# EAGLE design bms_board (EAGLE 6.5.0)
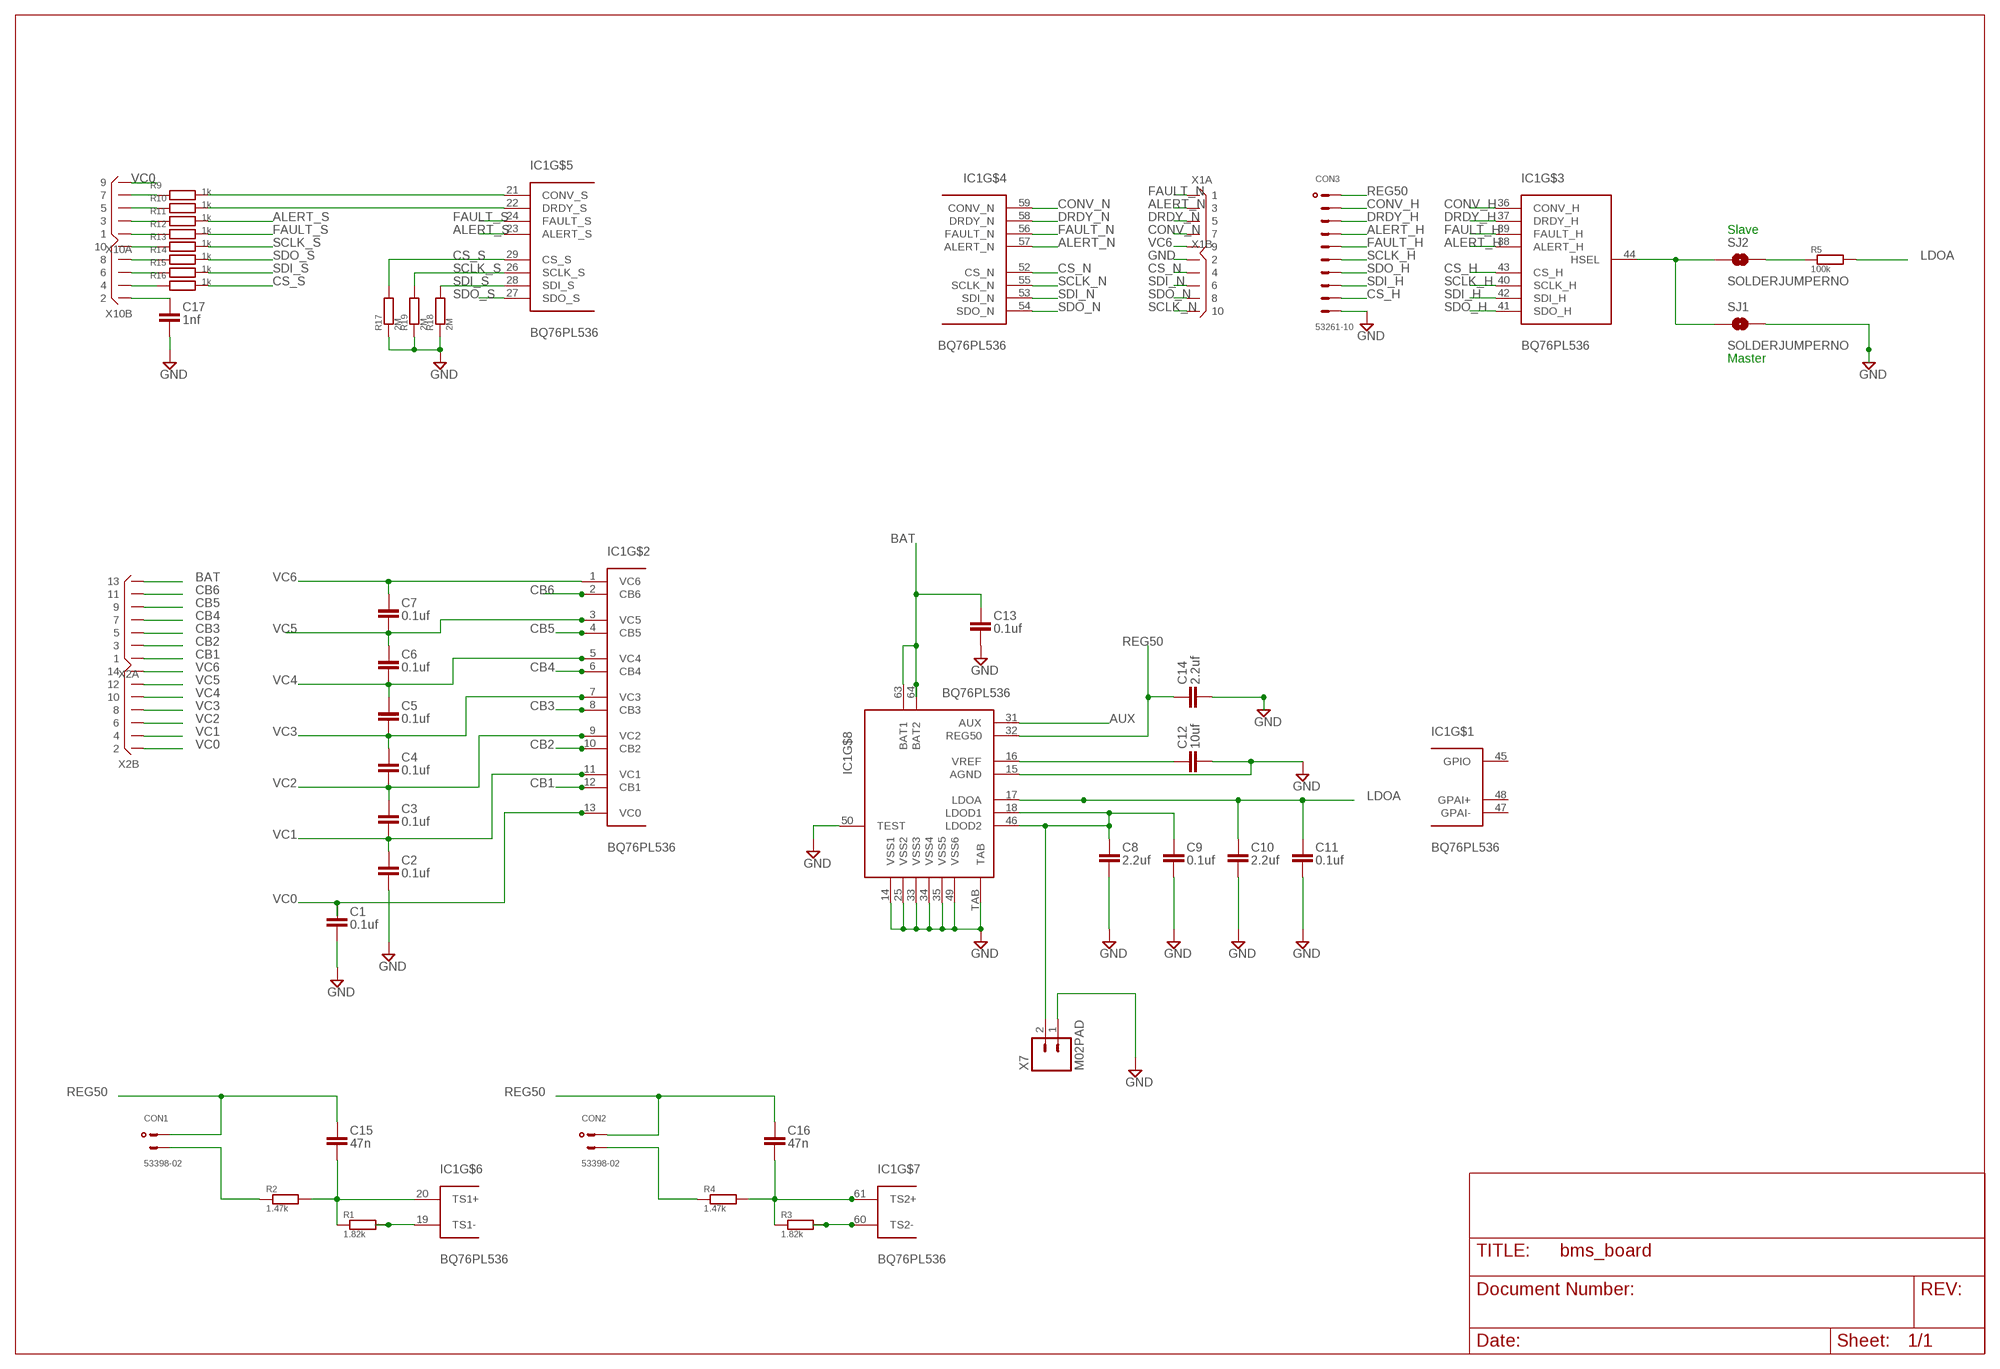
[diagram p0: schematic, sheet 1]

## Parts
C1  0.1uf  CSTD  [C0805]
C2  0.1uf  CSTD  [C0805]
C3  0.1uf  CSTD  [C0805]
C4  0.1uf  CSTD  [C0805]
C5  0.1uf  CSTD  [C0805]
C6  0.1uf  CSTD  [C0805]
C7  0.1uf  CSTD  [C0805]
C8  2.2uf  CSTD  [C0805]
C9  0.1uf  CSTD  [C0805]
C10  2.2uf  CSTD  [C0805]
C11  0.1uf  CSTD  [C0805]
C12  10uf  CSTD  [C0805]
C13  0.1uf  CSTD  [C0805]
C14  2.2uf  CSTD  [C0805]
C15  47n  CSTD  [C0805]
C16  47n  CSTD  [C0805]
C17  1nf  CSTD  [C0805]
CON1  53398-02  [53398-02]
CON2  53398-02  [53398-02]
CON3  53261-10  [53261-10]
IC1  BQ76PL536  [LQFP-64]
R1  1.82k  R  [R0805]
R2  1.47k  R  [R0805]
R3  1.82k  R  [R0805]
R4  1.47k  R  [R0805]
R5  100k  R  [R0805]
R9  1k  R  [R0805]
R10  1k  R  [R0805]
R11  1k  R  [R0805]
R12  1k  R  [R0805]
R13  1k  R  [R0805]
R14  1k  R  [R0805]
R15  1k  R  [R0805]
R16  1k  R  [R0805]
R17  2M  R  [R0805]
R18  2M  R  [R0805]
R19  2M  R  [R0805]
SJ1  SOLDERJUMPERNO  [SJ_2S-NO]
SJ2  SOLDERJUMPERNO  [SJ_2S-NO]
X1  X05X2ICR  [X10ICR]
X2  X07X2IR  [X14R-IDC]
X7  M02PAD  [1X02]
X10  X05X2ICR  [X10ICR]

## Nets
ALERT_H: CON3.4 IC1.38(ALERT_H)
ALERT_N: IC1.57(ALERT_N) X1.3
ALERT_S: IC1.23(ALERT_S) R11.2
AUX: IC1.31(AUX)
BAT: C13.2 IC1.63(BAT1) IC1.64(BAT2) X2.13
CB1: IC1.12(CB1) X2.1
CB2: IC1.10(CB2) X2.3
CB3: IC1.8(CB3) X2.5
CB4: IC1.6(CB4) X2.7
CB5: IC1.4(CB5) X2.9
CB6: IC1.2(CB6) X2.11
CONV_H: CON3.2 IC1.36(CONV_H)
CONV_N: IC1.59(CONV_N) X1.7
CONV_S: IC1.21(CONV_S) R9.2
CS_H: CON3.9 IC1.43(CS_H)
CS_N: IC1.52(CS_N) X1.4
CS_S: IC1.29(CS_S) R16.2 R17.2
DRDY_H: CON3.3 IC1.37(DRDY_H)
DRDY_N: IC1.58(DRDY_N) X1.5
DRDY_S: IC1.22(DRDY_S) R10.2
FAULT_H: CON3.5 IC1.39(FAULT_H)
FAULT_N: IC1.56(FAULT_N) X1.1
FAULT_S: IC1.24(FAULT_S) R12.2
GND: C1.1 C2.1 C8.1 C9.1 C10.1 C11.1 C12.1 C13.1 C14.1 C17.1 CON3.10 IC1.14(VSS1) IC1.15(AGND) IC1.25(VSS2) IC1.33(VSS3) IC1.34(VSS4) IC1.35(VSS5) IC1.49(VSS6) IC1.50(TEST) IC1.TAB R17.1 R18.1 R19.1 SJ1.2 X1.2 X7.1
LDOA: C10.2 C11.2 IC1.17(LDOA) R5.2
N$1: IC1.44(HSEL) SJ1.1 SJ2.1
N$2: C8.2 C9.2 IC1.18(LDOD1) IC1.46(LDOD2) X7.2
N$3: C12.2 IC1.16(VREF)
N$4: IC1.19(TS1-) R1.2
N$5: CON1.2 R2.1
N$6: C15.1 IC1.20(TS1+) R1.1 R2.2
N$7: IC1.60(TS2-) R3.2
N$8: C16.1 IC1.61(TS2+) R3.1 R4.2
N$9: CON2.2 R4.1
N$10: R5.1 SJ2.2
N$23: R16.1 X10.4
N$24: R15.1 X10.6
N$25: R14.1 X10.8
N$26: R13.1 X10.10
N$27: R12.1 X10.1
N$28: R11.1 X10.3
N$29: R10.1 X10.5
N$30: R9.1 X10.7
N$32: C17.2 X10.2
REG50: C14.2 C15.2 C16.2 CON1.1 CON2.1 CON3.1 IC1.32(REG50)
SCLK_H: CON3.6 IC1.40(SCLK_H)
SCLK_N: IC1.55(SCLK_N) X1.10
SCLK_S: IC1.26(SCLK_S) R13.2 R19.2
SDI_H: CON3.8 IC1.42(SDI_H)
SDI_N: IC1.53(SDI_N) X1.6
SDI_S: IC1.28(SDI_S) R15.2 R18.2
SDO_H: CON3.7 IC1.41(SDO_H)
SDO_N: IC1.54(SDO_N) X1.8
SDO_S: IC1.27(SDO_S) R14.2
VC0: C1.2 IC1.13(VC0) X2.2 X10.9
VC1: C2.2 C3.1 IC1.11(VC1) X2.4
VC2: C3.2 C4.1 IC1.9(VC2) X2.6
VC3: C4.2 C5.1 IC1.7(VC3) X2.8
VC4: C5.2 C6.1 IC1.5(VC4) X2.10
VC5: C6.2 C7.1 IC1.3(VC5) X2.12
VC6: C7.2 IC1.1(VC6) X1.9 X2.14
Unconnected: IC1.45(GPIO) IC1.47(GPAI-) IC1.48(GPAI+)

## Notes on the sheet
- Slave
- Master

## Library data of the parts
C1-C17 = useful:C
CON1 CON2 = con-molex:53?-02: CONNECTOR wire to board 1.25 mm (.049 inch) pitch header
CON3 = con-molex:53?-10: CONNECTOR wire to board 1.25 mm (.049 inch) pitch header
IC1 = ti:BQ76PL536
R1-R5 R9-R19 = useful:R
SJ1 SJ2 = useful:SOLDERJUMPER: Solder Jumper Standard SMD solder jumper. Used to automate production. Two varients : Normally Open and Normally Closed are the same, but have different paste layers. NC will have a large amount of paste and should jumper during reflow.
X1 X10 = connectors:X05X2: Connector 2x5 pins
X2 = connectors:X07X2: Connector 2x7 pins
X7 = stiftleisten:M02

## Board
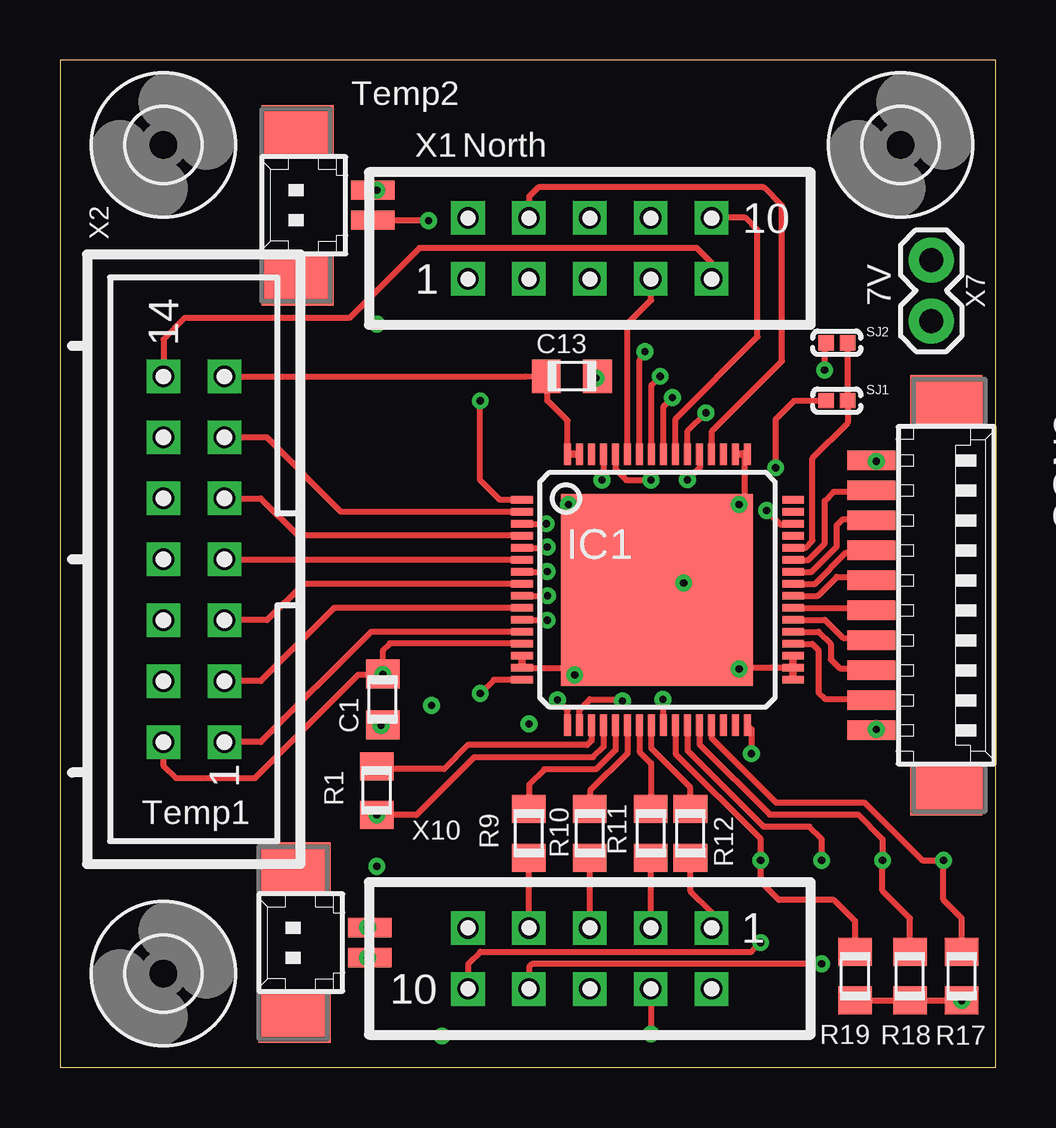
[diagram p1: board, top side]
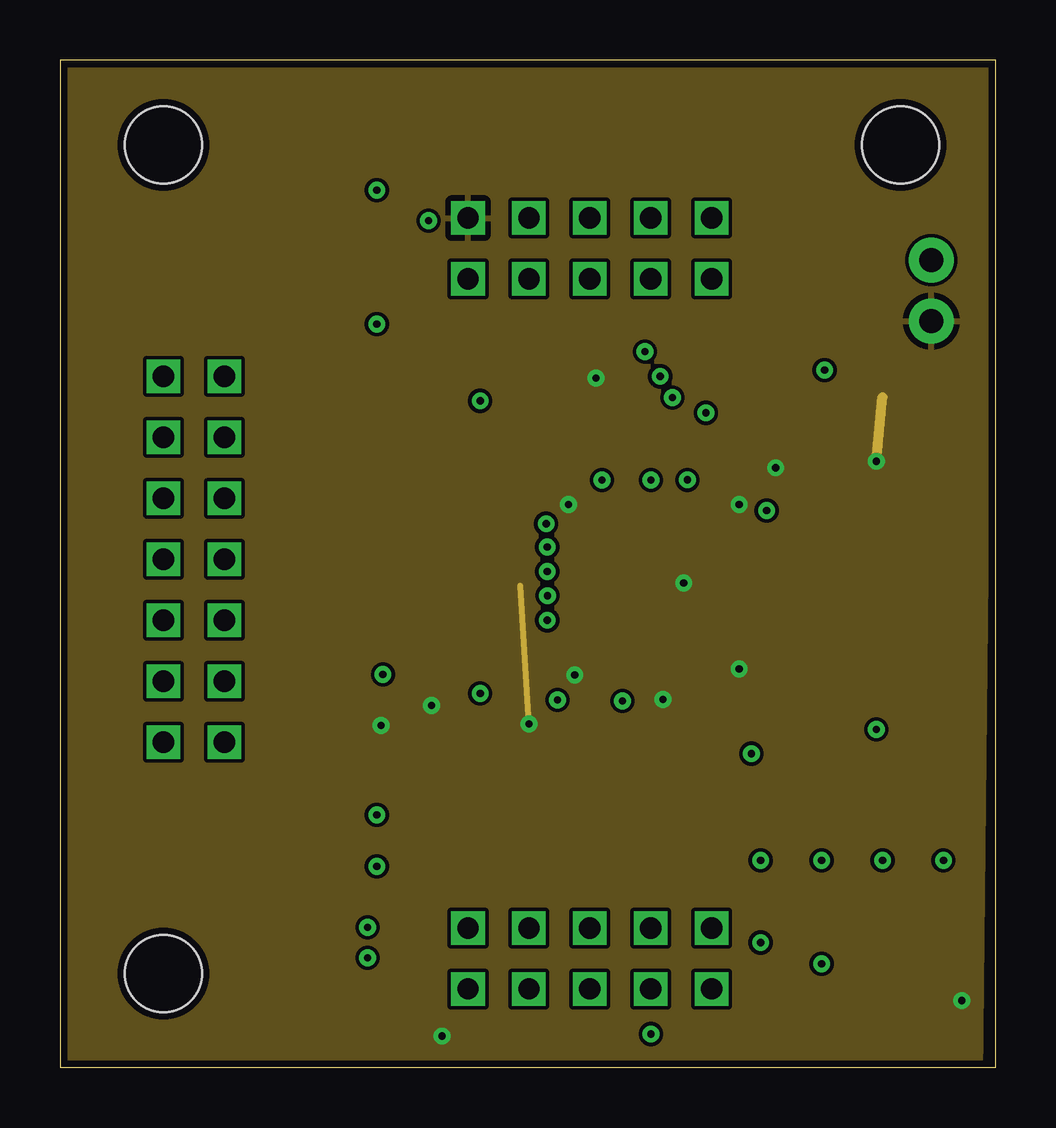
[diagram p2: board, inner layer Route2]
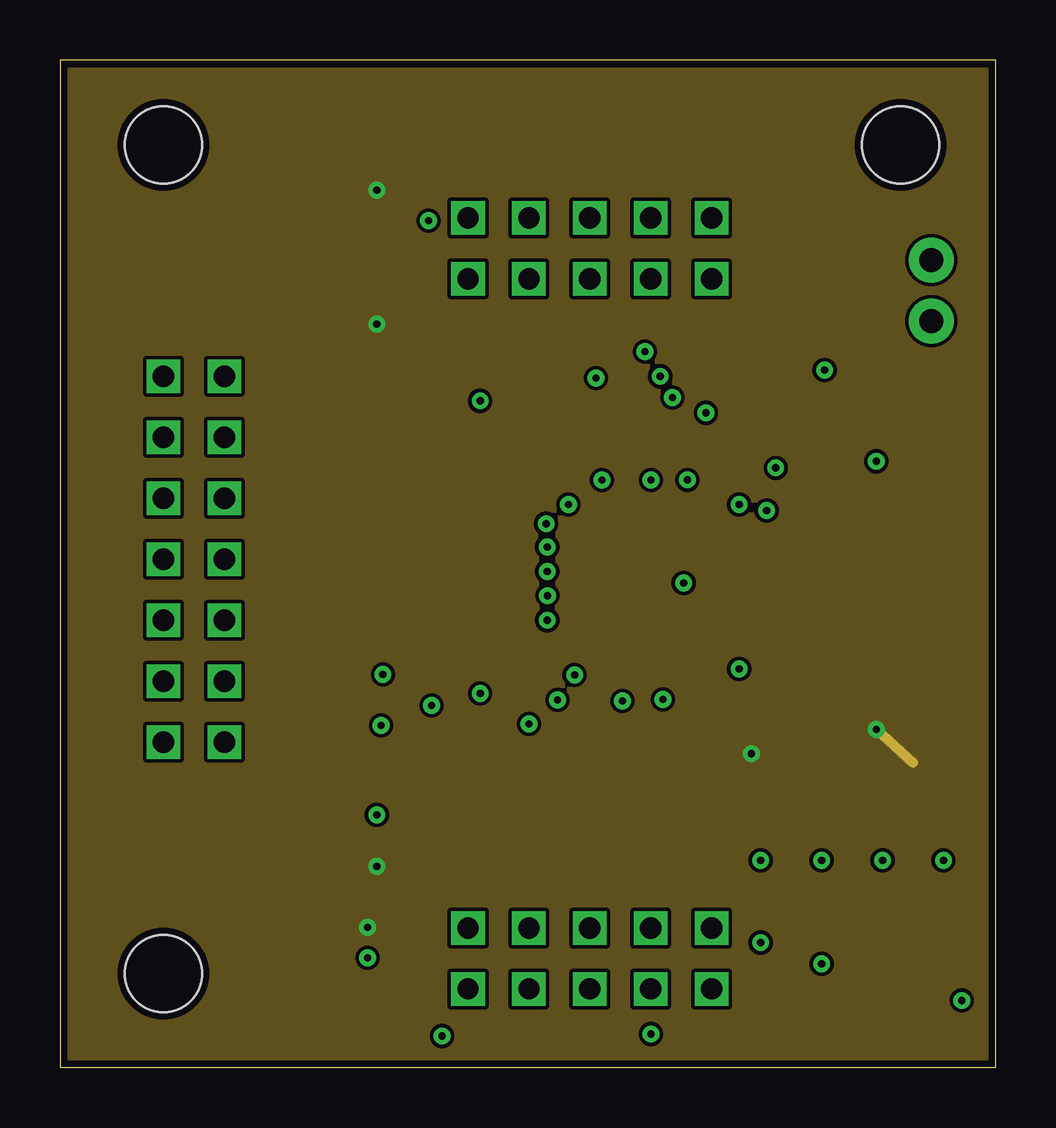
[diagram p3: board, inner layer Route15]
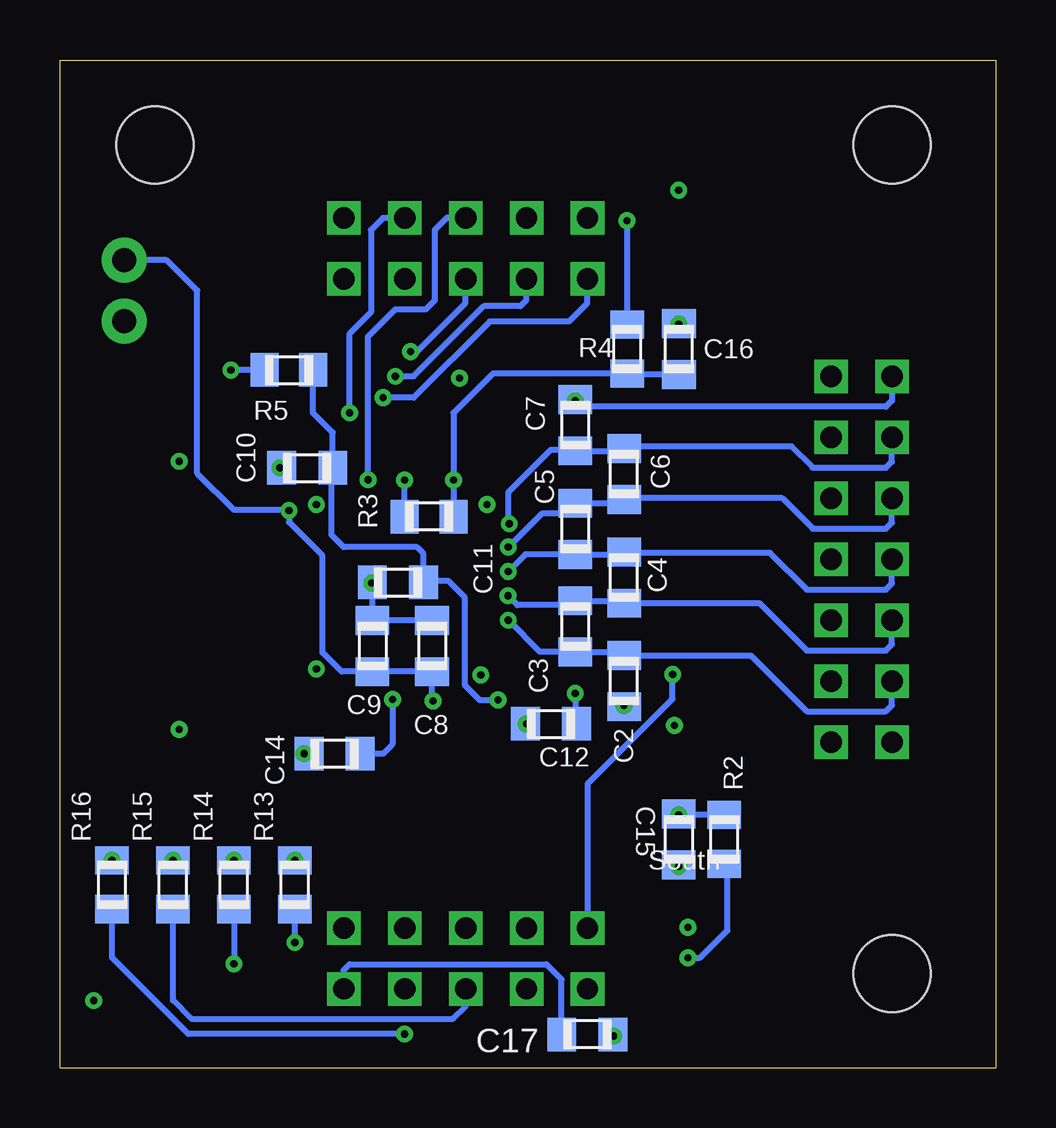
[diagram p4: board, bottom side, seen from below]

Size 39 x 42 mm. Coordinates in mm from the lower left corner, seen from the top.
Outline: 39,0 39,42 0,42 0,0 39,0
Copper layers (1+2*15+16): Top 0.035mm / dielectric 0.2mm / Route2 0.035mm / dielectric 0.5mm / Route15 0.035mm / dielectric 0.2mm / Bottom 0.035mm
Design rules "ats_35u_4layer_2 *": minimum track width 10mil, minimum drill 0.2mm, track to track 6mil, track to pad 6mil, pad to pad 6mil, via to via 6mil, smd to smd 6mil, copper to edge 0.3mm, drill to drill 8mil, minimum pad ring 10mil, minimum via ring 0.2mm, stop-mask expansion 4mil, vias tented up to drill 0mil, thermal gap 10mil

### Footprints (pad centres in the part's own frame; a part is rotated, then mirrored left to right if it is on the bottom)
C0805 = smd 1.2 x 1.4: 1 -1.066,0; 2 1.066,0
53398-02 = smd 0.8 x 1.8: 1 0.625,-2.5; 2 -0.625,-2.5 | smd 2.1 x 3: S1 3.125,0.625; S2 -3.125,0.625
53261-10 = smd 0.8 x 2: 1 5.625,-2.5; 2 4.375,-2.5; 3 3.125,-2.5; 4 1.875,-2.5; 5 0.625,-2.5; 6 -0.625,-2.5; 7 -1.875,-2.5; 8 -3.125,-2.5; 9 -4.375,-2.5; 10 -5.625,-2.5 | smd 2.1 x 3: S1 8.125,0.625; S2 -8.125,0.625
LQFP-64 = smd 0.9 x 0.3: 1 -5.625,3.75; 2 -5.625,3.25; 3 -5.625,2.75; 4 -5.625,2.25; 5 -5.625,1.75; 6 -5.625,1.25; 7 -5.625,0.75; 8 -5.625,0.25; 9 -5.625,-0.25; 10 -5.625,-0.75; 11 -5.625,-1.25; 12 -5.625,-1.75; 13 -5.625,-2.25; 14 -5.625,-2.75; 15 -5.625,-3.25; 16 -5.625,-3.75; 33 5.675,-3.75; 34 5.675,-3.25; 35 5.675,-2.75; 36 5.675,-2.25; 37 5.675,-1.75; 38 5.675,-1.25; 39 5.675,-0.75; 40 5.675,-0.25; 41 5.675,0.25; 42 5.675,0.75; 43 5.675,1.25; 44 5.675,1.75; 45 5.675,2.25; 46 5.675,2.75; 47 5.675,3.25; 48 5.675,3.75 | smd 0.3 x 0.9: 17 -3.725,-5.65; 18 -3.225,-5.65; 19 -2.725,-5.65; 20 -2.225,-5.65; 21 -1.725,-5.65; 22 -1.225,-5.65; 23 -0.725,-5.65; 24 -0.225,-5.65; 25 0.275,-5.65; 26 0.775,-5.65; 27 1.275,-5.65; 28 1.775,-5.65; 29 2.275,-5.65; 30 2.775,-5.65; 31 3.275,-5.65; 32 3.775,-5.65; 49 3.775,5.65; 50 3.275,5.65; 51 2.775,5.65; 52 2.275,5.65; 53 1.775,5.65; 54 1.275,5.65; 55 0.775,5.65; 56 0.275,5.65; 57 -0.225,5.65; 58 -0.725,5.65; 59 -1.225,5.65; 60 -1.725,5.65; 61 -2.225,5.65; 62 -2.725,5.65; 63 -3.225,5.65; 64 -3.725,5.65 | smd 8 x 8: TAB 0,0
R0805 = smd 1.168 x 1.397: 1 -1.016,0; 2 1.016,0
SJ_2S-NO = smd 0.635 x 0.635: 1 -0.45,0; 2 0.45,0
3,2 = hole 3.2: 0,0
X10ICR = drill 0.889 pad 1.397 square: 1 -5.08,-1.27; 2 -5.08,1.27; 3 -2.54,-1.27; 4 -2.54,1.27; 5 0,-1.27; 6 0,1.27; 7 2.54,-1.27; 8 2.54,1.27; 9 5.08,-1.27; 10 5.08,1.27
X14R-IDC = drill 0.889 pad 1.397 square: 1 -7.62,-1.27; 2 -7.62,1.27; 3 -5.08,-1.27; 4 -5.08,1.27; 5 -2.54,-1.27; 6 -2.54,1.27; 7 0,-1.27; 8 0,1.27; 9 2.54,-1.27; 10 2.54,1.27; 11 5.08,-1.27; 12 5.08,1.27; 13 7.62,-1.27; 14 7.62,1.27
1X02 = drill 1 pad 1.88: 1 0,0; 2 2.54,0

### Placement (x,y rotation side)
C1  13.45,15.34 90 top
C2  15.49,16.11 90 bottom
C3  17.52,18.39 90 bottom
C4  15.49,20.42 90 bottom
C5  17.52,22.46 90 bottom
C6  15.49,24.74 90 bottom
C7  17.52,26.77 90 bottom
C8  23.49,17.57 270 bottom
C9  25.98,17.57 270 bottom
C10  28.69,25 0 bottom
C11  24.91,20.22 0 bottom
C12  18.53,14.33 0 bottom
C13  21.34,28.81 180 top
C14  27.55,13.08 180 bottom
C15  13.21,9.51 270 bottom
C16  13.2,29.95 90 bottom
C17  17.02,1.38 180 bottom
CON1  10.41,5.21 90 top
CON2  10.54,35.94 90 top
CON3  36.32,19.68 270 top
IC1  24.88,19.92 0 top
R1  13.21,11.54 90 top
R2  11.3,9.51 90 bottom
R3  23.61,22.96 180 bottom
R4  15.36,29.95 270 bottom
R5  29.46,29.08 0 bottom
R9  19.55,9.76 90 top
R10  22.09,9.76 90 top
R11  24.63,9.76 90 top
R12  26.28,9.76 90 top
R13  29.21,7.62 90 bottom
R14  31.75,7.62 90 bottom
R15  34.29,7.62 90 bottom
R16  36.83,7.62 90 bottom
R17  37.59,3.81 90 top
R18  35.43,3.81 90 top
R19  33.15,3.81 90 top
SJ1  32.38,27.8 180 top
SJ2  32.38,30.21 180 top
U$3  [3,2]  4.31,38.46 0 top
U$4  [3,2]  4.31,3.91 0 top
U$6  [3,2]  35.04,38.46 0 top
X1  22.09,34.14 0 top
X2  5.58,21.19 90 top
X7  36.32,31.12 90 top
X10  22.09,4.55 180 top

### Tracks (layer width: path | path; a pad name or v marks a point on that pad's centre or on a via)
ALERT_H
  Top 0.254: IC1.38 31.88,18.67 32.64,17.91 33.73,17.91
  Top 0.406: CON3.4 33.73,17.81 33.73,17.91
ALERT_N  (via drill 0.3)
  Top 0.254: IC1.57 24.66,28.45 v25.02,28.81
  Bottom 0.254: v25.02,28.81 24.26,28.81 21.34,31.73 19.81,31.73 19.56,31.99 X1.3
ALERT_S
  Top 0.254: IC1.23 24.16,13.16 24.64,12.69 R11.2
BAT
  Top 0.254: X2.13 19.42,28.81 C13.2 20.32,28.76 20.32,27.8 21.16,26.96 IC1.64
  Top 0.305: IC1.63 IC1.64
CB1
  Top 0.254: IC1.12 12.97,18.17 8.37,13.57 X2.1
CB2
  Top 0.254: IC1.10 11.43,19.17 8.37,16.11 X2.3
CB3
  Top 0.254: IC1.8 10.15,20.17 8.63,18.65 X2.5
CB4
  Top 0.254: IC1.6 6.87,21.17 X2.7
CB5
  Top 0.254: X2.9 8.37,23.73 9.9,22.2 19.22,22.2 IC1.4
CB6
  Top 0.254: IC1.2 11.73,23.17 8.63,26.27 X2.11
CONV_H
  Top 0.254: IC1.36 31.36,17.67 31.62,17.4 31.62,15.62 31.88,15.37 33.77,15.37
  Top 0.406: CON3.2 33.77,15.31 33.77,15.37
CONV_N
  Top 0.254: IC1.59 23.66,31.01 24.64,31.99 X1.7
CONV_S
  Top 0.254: IC1.21 23.16,13.24 22.35,12.43 20.19,12.43 19.56,11.8 R9.2
CS_H
  Top 0.254: IC1.43 31.2,21.17 31.88,21.84 31.88,23.62 32.26,24 33.77,24
  Top 0.406: CON3.9 33.77,24.06 33.77,24
CS_N
  Top 0.254: IC1.52 27.18,25.59 27.18,26.53 30.1,29.45 30.1,35.93 29.34,36.69 19.94,36.69 19.56,36.31 X1.4
CS_S  (via drill 0.3)
  Top 0.254: R17.2 37.59,6.22 36.83,6.99 R16.2 35.94,8.64 33.53,11.05 29.84,11.05 27.16,13.73 IC1.29
  other vias: 36.83,8.64
DRDY_H
  Top 0.254: IC1.37 31.62,18.17 32.13,17.65 32.13,17.02 32.51,16.64 33.74,16.64
  Top 0.406: CON3.3 33.74,16.56 33.74,16.64
DRDY_N  (via drill 0.3)
  Top 0.254: IC1.58 24.16,29.48 v24.38,29.85
  Bottom 0.254: X1.5 22.1,31.86 24.11,29.85 v24.38,29.85
DRDY_S
  Top 0.254: IC1.22 23.66,13.1 22.1,11.54 R10.2
FAULT_H
  Top 0.254: IC1.39 33.72,19.17
  Top 0.406: CON3.5 33.72,19.06 33.72,19.17
FAULT_N  (via drill 0.3)
  Top 0.254: IC1.56 25.16,27.56 v25.53,27.93
  Bottom 0.254: v25.53,27.93 24.26,27.93 21.08,31.1 17.78,31.1 17.02,31.86 X1.1
FAULT_S
  Top 0.254: R12.2 26.28,11.68 24.64,13.32 24.64,14.24 IC1.24
GND  (via drill 0.3)
  Top 0.254: C1.1 13.38,14.25 v13.39,14.26 | C13.1 v22.34,28.74 | 21.53,16.61 21.71,16.61 arc-127 v21.45,16.36 | v21.45,16.36 21.33,16.36 | IC1.15 21.15,16.67 v21.45,16.36 | 28.55,23.71 28.55,25.46 IC1.49 | 25.16,17.16 25.01,17.31 27.36,17.31 v28.31,16.61 28.36,16.67 IC1.34 | v29.84,25 29.84,27.03 30.61,27.8 SJ1.2 | R19.1 R18.1 R17.1 | v25.14,15.34 25.14,14.29 IC1.25
  Top 0.305: IC1.15 IC1.14 | 28.45,23.61 v28.31,23.47 28.55,23.71 | IC1.50 IC1.49 | 28.57,16.61 v28.31,16.61 | IC1.35 IC1.34 IC1.33
  Top 0.406: IC1.TAB 21.53,16.61 | CON3.10 34.04,25.18 v34.04,25.27
  Route2 0.254: v19.55,14.33 19.2,20.08
  Route2 0.406: v34.04,25.27 34.29,27.94
  Bottom 0.254: 15.61,15.09 C2.1 v15.49,15.09 | C8.1 C9.1 C11.1 v26,20.2 | C12.1 19.6,14.53 v19.55,14.33 | v29.84,25 C10.1 | 28.44,16.49 v28.31,16.61 | v25.14,15.34 25.14,13.47 25.53,13.08 C14.1
  Bottom 0.406: C17.1 16.06,1.25 v15.93,1.31
  other vias: 21.2,23.47 37.59,2.79
  pour Route2: -0.42,-0.27 38.37,-0.4 38.94,50.96 0.15,51.06
LDOA  (via drill 0.3)
  Top 0.254: IC1.17 21.16,14.9 v20.74,15.32
  Bottom 0.254: v20.74,15.32 21.51,15.32 22.11,15.93 22.11,19.59 22.8,20.27 23.8,20.27 C11.2 23.85,21.42 24.12,21.69 27.17,21.69 27.68,22.2 27.68,24.95 C10.2 27.63,26.47 28.45,27.29 28.45,29.07 R5.2
N$1
  Top 0.254: SJ1.1 SJ2.1 | IC1.44 31.06,21.67 31.37,21.97 31.37,25.4 32.84,26.87 SJ1.1 | 32.89,27.74 SJ1.1 | 32.77,27.73 SJ1.1
N$2  (via drill 0.3)
  Top 0.254: 23.41,15.24 v23.45,15.28 23.39,15.34 22.09,15.34 21.66,14.91 IC1.18 | IC1.46 30.44,22.63 30.04,22.63 v29.46,23.22
  Bottom 0.254: v23.45,15.28 23.49,15.32 C8.2 C9.2 27.26,16.5 28.06,17.3 28.06,21.34 29.46,22.73 v29.46,23.22 29.48,23.24 31.75,23.24 33.27,24.77 33.27,32.39 34.54,33.66 X7.2
N$3  (via drill 0.3)
  Top 0.254: IC1.16 18.09,16.17 v17.52,15.6
  Bottom 0.254: v17.52,15.6 17.52,14.12 C12.2
N$4
  Top 0.254: IC1.19 22.16,13.63 21.97,13.45 21.95,13.46 17.02,13.46 16,12.45 13.32,12.45 R1.2 13.36,12.81
N$5  (via drill 0.3)
  Top 0.254: CON1.2 13.22,4.46 v12.83,4.57
  Bottom 0.254: v12.83,4.57 12.32,4.57 11.18,5.72 11.18,8.37 R2.1
N$6  (via drill 0.3)
  Top 0.254: C15.1 13.29,10.53 R1.1 14.86,10.53 17.27,12.94 22.23,12.94 22.66,13.37 IC1.20
  Bottom 0.254: 13.2,10.62 C15.1 13.29,10.58 R1.1 R2.2
  other vias: 13.21,10.53
N$7  (via drill 0.3)
  Top 0.254: IC1.60 23.16,24.94 23.61,24.49 v24.63,24.49
  Bottom 0.254: R3.2 v24.63,24.49
N$8  (via drill 0.3)
  Top 0.254: IC1.61 22.66,24.55 v22.6,24.49
  Bottom 0.254: R3.1 v22.6,24.49 22.6,27.28 20.95,28.93 R4.2 | 15.31,28.88 R4.2 | C16.1 15.36,28.88 R4.2
N$9  (via drill 0.3)
  Top 0.254: CON2.2 15.36,35.32 v15.37,35.31
  Bottom 0.254: v15.37,35.31 R4.1
N$10  (via drill 0.3)
  Top 0.254: v31.88,29.07 31.88,30.41 SJ2.2
  Bottom 0.254: R5.1 v31.87,29.08 v31.88,29.07
N$23  (via drill 0.3)
  Top 0.254: X10.4 v24.63,1.41 v24.64,1.4
  Bottom 0.254: v24.64,1.4 33.66,1.4 36.83,4.57 R16.1
N$24
  Bottom 0.254: X10.6 22.1,2.54 22.61,2.03 33.53,2.03 34.29,2.79 R15.1
N$25  (via drill 0.3)
  Top 0.254: v31.75,4.32 19.68,4.32 19.56,4.19 X10.8
  Bottom 0.254: R14.1 v31.75,4.32
N$26  (via drill 0.3)
  Top 0.254: X10.10 17.02,4.32 17.53,4.83 28.83,4.83 v29.21,5.21
  Bottom 0.254: R13.1 v29.21,5.21
N$27
  Top 0.254: X10.1 27.17,6.47 26.29,7.35 R12.1
N$28
  Top 0.254: X10.3 R11.1
N$29
  Top 0.254: X10.5 R10.1
N$30
  Top 0.254: X10.7 R9.1
N$32
  Bottom 0.254: X10.2 27.18,4.05 26.92,4.3 18.72,4.3 18.08,3.67 C17.2
REG50  (via drill 0.3)
  Top 0.254: CON1.1 12.96,5.85 v12.83,5.84 | CON2.1 12.94,36.57 v13.21,36.58 | v28.83,13.08 28.83,14.1 IC1.32
  Top 0.406: CON3.1 34.29,13.85 v34.04,14.1
  Route15 0.406: v34.04,14.1 35.56,12.7
  Bottom 0.254: 12.82,30.96 C16.2 13.2,31.11 v13.21,30.99 | v13.21,8.38 C15.2 13.15,8.44 v13.21,8.38 | v13.21,8.38 13.21,8.37 | C14.2 28.45,13.08 v28.83,13.08
  pour Route15: 0.11,51.01 39.11,50.97 39.11,-0.14 -0.02,0.3
SCLK_H
  Top 0.254: IC1.40 31.6,19.67 32.38,20.45 33.69,20.45
  Top 0.406: CON3.6 33.69,20.31 33.69,20.45
SCLK_N
  Top 0.254: IC1.55 25.66,27.04 29.08,30.46 29.08,34.91 28.57,35.42 X1.10
SCLK_S  (via drill 0.3)
  Top 0.254: IC1.26 25.66,13.08 29.21,9.53 R13.2 29.21,7.75 29.97,6.99 32.26,6.99 33.15,6.1 R19.2
  other vias: 29.21,8.64
SDI_H
  Top 0.254: IC1.42 31.33,20.67 32.38,21.72 32.38,22.61 32.64,22.86 33.77,22.86
  Top 0.406: CON3.8 33.77,22.81 33.77,22.86
SDI_N  (via drill 0.3)
  Top 0.254: IC1.53 26.67,25.55 26.67,25 v26.16,24.5
  Bottom 0.254: v26.16,24.5 26.16,30.46 25.02,31.61 23.75,31.61 23.37,31.99 23.37,34.93 22.86,35.43 22.11,35.43 X1.6
SDI_S  (via drill 0.3)
  Top 0.254: IC1.28 26.66,13.47 29.59,10.54 33.27,10.54 34.29,9.53 R15.2 34.29,7.37 35.43,6.22 R18.2
  other vias: 34.29,8.64
SDO_H
  Top 0.254: IC1.41 31.47,20.17 32.77,21.46 33.73,21.46
  Top 0.406: CON3.7 33.73,21.56 33.73,21.46
SDO_N  (via drill 0.3)
  Top 0.254: IC1.54 26.16,26.52 v26.92,27.29
  Bottom 0.254: v26.92,27.29 26.92,30.59 26.04,31.48 26.04,34.91 25.54,35.41 X1.8
SDO_S  (via drill 0.3)
  Top 0.254: IC1.27 26.16,13.21 29.34,10.03 31.24,10.03 31.75,9.53 R14.2
  Bottom 0.254: 32.13,8.64 R14.2
  other vias: 31.75,8.64
VC0  (via drill 0.3)
  Top 0.254: IC1.13 19.25,17.68 13.76,17.68 13.45,17.38 C1.2 | X2.2 4.31,12.58 4.83,12.07 8.13,12.07 12.45,16.38 13.43,16.38 C1.2 | v13.46,16.38 13.46,16.4 C1.2
  Bottom 0.254: v13.46,16.38 13.46,15.37 17,11.83 X10.9
VC1  (via drill 0.3)
  Top 0.254: IC1.11 20.29,18.67 v20.31,18.65
  Bottom 0.254: v20.31,18.65 18.99,17.33 C3.1 15.64,17.33 C2.2 10.2,17.17 7.87,14.84 4.57,14.84 4.32,15.1 4.32,16.1 X2.4
VC2  (via drill 0.3)
  Top 0.254: IC1.9 20.06,19.67 v20.32,19.67
  Bottom 0.254: 17.64,19.28 19.93,19.28 v20.32,19.67 | C3.2 15.59,19.46 C4.1 9.85,19.36 7.87,17.38 4.57,17.38 4.32,17.64 4.32,18.64 X2.6
  Bottom 0.305: C3.2 17.64,19.28
VC3  (via drill 0.3)
  Top 0.254: IC1.7 20.05,20.67 v20.31,20.68
  Bottom 0.254: v20.31,20.68 19.6,21.39 C5.1 15.59,21.39 C4.2 15.44,21.45 9.4,21.45 7.87,19.92 4.57,19.92 4.32,20.18 4.32,21.18 X2.8
VC4  (via drill 0.3)
  Top 0.254: IC1.5 20.03,21.67 v20.31,21.69
  Bottom 0.254: C5.2 15.64,23.52 C6.1 15.43,23.73 8.89,23.73 7.62,22.46 4.57,22.46 4.32,22.72 4.32,23.72 X2.10 | 17.64,23.09 18.91,23.09 v20.31,21.69
  Bottom 0.305: C5.2 17.64,23.09 17.64,23.17
VC5  (via drill 0.3)
  Top 0.254: IC1.3 v20.27,22.67
  Bottom 0.254: v20.27,22.67 20.31,22.71 20.31,23.98 18.53,25.76 17.57,25.76 C7.1 15.59,25.71 C6.2 15.4,25.89 8.51,25.89 7.62,25 4.57,25 4.32,25.26 4.32,26.26 X2.12
VC6  (via drill 0.3)
  Top 0.254: IC1.1 18.34,23.67 17.52,24.49 v17.52,27.79 | X1.9 27.17,33.54 26.54,34.16 14.99,34.16 12.06,31.24 5.21,31.24 4.32,30.35 X2.14
  Bottom 0.254: C7.2 17.47,27.79 v17.52,27.79 17.27,27.54 4.57,27.54 4.32,27.8 4.32,28.8 X2.14

### Text on the board
tPlace: North
bPlace: South
tNames: Temp2 | 7V | Temp1
tTest: SLAVE
bTest: BMS / V2 / Moni | Bottom